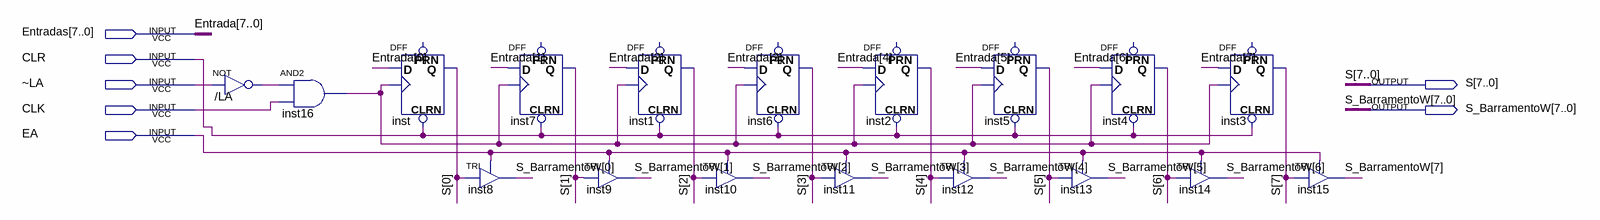
[diagram p0: schematic sheet]
// Quartus schematic Acumulador_A.bdf as structural Verilog: 18 symbols, 7 pins
module Acumulador_A (
  input  [7:0] Entradas,
  input  CLR,
  input  \~LA ,
  input  CLK,
  input  EA,
  output [7:0] S,
  output [7:0] S_BarramentoW
);

  wire _LA_out, inst16_out;

  not \u_/LA  (_LA_out, \~LA );
  and inst16 (inst16_out, _LA_out, CLK);
  DFF inst (.CLRN(CLR), .CLK(inst16_out), .D(Entradas[0]), .Q(S[0]));  // open: PRN
  TRI inst8 (.IN(S[0]), .OE(EA), .OUT(S_BarramentoW[0]));
  DFF inst7 (.CLRN(CLR), .CLK(inst16_out), .D(Entradas[1]), .Q(S[1]));  // open: PRN
  TRI inst9 (.IN(S[1]), .OE(EA), .OUT(S_BarramentoW[1]));
  DFF inst1 (.CLRN(CLR), .CLK(inst16_out), .D(Entradas[2]), .Q(S[2]));  // open: PRN
  TRI inst10 (.IN(S[2]), .OE(EA), .OUT(S_BarramentoW[2]));
  DFF inst6 (.CLRN(CLR), .CLK(inst16_out), .D(Entradas[3]), .Q(S[3]));  // open: PRN
  DFF inst2 (.CLRN(CLR), .CLK(inst16_out), .D(Entradas[4]), .Q(S[4]));  // open: PRN
  TRI inst11 (.IN(S[3]), .OE(EA), .OUT(S_BarramentoW[3]));
  TRI inst12 (.IN(S[4]), .OE(EA), .OUT(S_BarramentoW[4]));
  DFF inst5 (.CLRN(CLR), .CLK(inst16_out), .D(Entradas[5]), .Q(S[5]));  // open: PRN
  TRI inst13 (.IN(S[5]), .OE(EA), .OUT(S_BarramentoW[5]));
  DFF inst4 (.CLRN(CLR), .CLK(inst16_out), .D(Entradas[6]), .Q(S[6]));  // open: PRN
  TRI inst14 (.IN(S[6]), .OE(EA), .OUT(S_BarramentoW[6]));
  DFF inst3 (.CLRN(CLR), .CLK(inst16_out), .D(Entradas[7]), .Q(S[7]));  // open: PRN
  TRI inst15 (.IN(S[7]), .OE(EA), .OUT(S_BarramentoW[7]));

  // Other names for the same wires on the sheet: Entrada[7:0] = Entradas
endmodule
